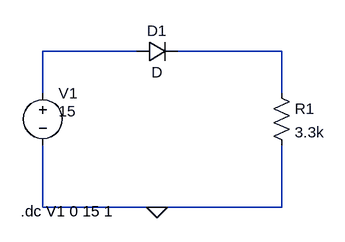
[diagram p0: schematic 2_2_Vout_by_Vin.asc]
2_2_Vout_by_Vin.asc, the LTspice schematic file:
Version 4
SHEET 1 880 680
WIRE 256 80 112 80
WIRE 480 80 320 80
WIRE 112 144 112 80
WIRE 480 144 480 80
WIRE 112 320 112 224
WIRE 288 320 112 320
WIRE 480 320 480 224
WIRE 480 320 288 320
FLAG 288 320 0
SYMBOL voltage 112 128 R0
WINDOW 3 24 44 Left 2
WINDOW 123 0 0 Left 0
WINDOW 39 0 0 Left 0
SYMATTR InstName V1
SYMATTR Value 15
SYMBOL diode 256 96 R270
WINDOW 0 32 32 VTop 2
WINDOW 3 0 32 VBottom 2
SYMATTR InstName D1
SYMBOL res 464 128 R0
SYMATTR InstName R1
SYMATTR Value 3.3k
TEXT 78 326 Left 2 !.dc V1 0 15 1

The netlist it stands for:
* 2_2_Vout_by_Vin.asc
V1 N001 0 15
D1 N001 N002 D
R1 N002 0 3.3k
.model D D
.lib standard.dio
.dc V1 0 15 1
.backanno
.end